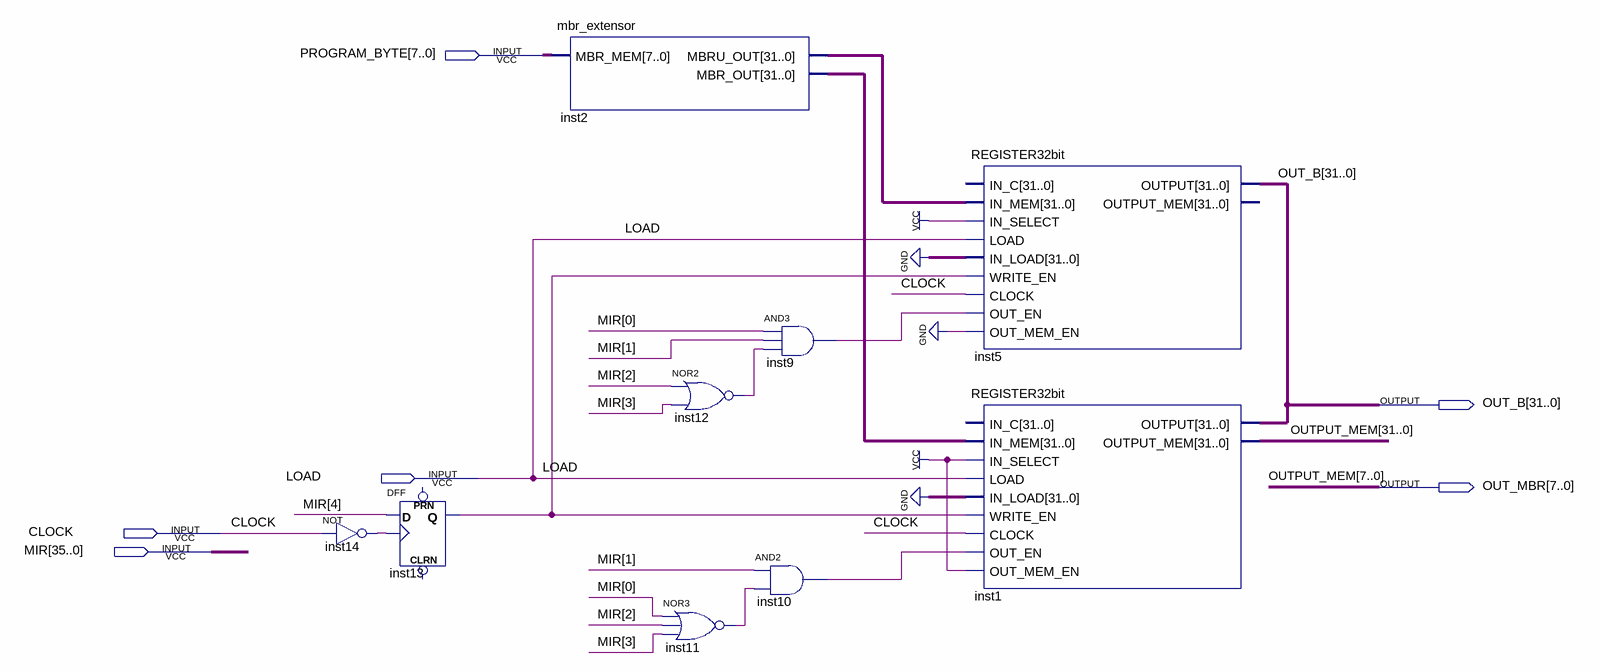
[diagram p0: schematic sheet]
// Quartus schematic MBR.bdf as structural Verilog: 9 symbols, 6 pins
module MBR (
  input  [7:0] PROGRAM_BYTE,
  input  LOAD,
  input  CLOCK,
  input  [35:0] MIR,
  output [31:0] OUT_B,
  output [7:0] OUT_MBR
);

  wire inst9_out, inst10_out, inst11_out, inst12_out, inst13_q, inst14_out;
  wire [31:0] inst2_mbr_out, inst2_mbru_out;
  wire [31:8] OUTPUT_MEM;

  DFF inst13 (.CLK(inst14_out), .D(MIR[4]), .Q(inst13_q));  // open: CLRN, PRN
  not inst14 (inst14_out, CLOCK);
  mbr_extensor inst2 (.MBR_MEM(PROGRAM_BYTE), .MBRU_OUT(inst2_mbru_out), .MBR_OUT(inst2_mbr_out));
  nor inst12 (inst12_out, MIR[2], MIR[3]);
  nor inst11 (inst11_out, MIR[0], MIR[2], MIR[3]);
  and inst10 (inst10_out, MIR[1], inst11_out);
  and inst9 (inst9_out, MIR[0], MIR[1], inst12_out);
  REGISTER32bit inst5 (
    .IN_MEM(inst2_mbru_out), .IN_SELECT(1'b1), .LOAD(LOAD), .IN_LOAD({32{1'b0}}), .WRITE_EN(inst13_q),
    .CLOCK(CLOCK), .OUT_EN(inst9_out), .OUT_MEM_EN(1'b0), .OUTPUT(OUT_B));  // open: IN_C, OUTPUT_MEM
  REGISTER32bit inst1 (
    .IN_MEM(inst2_mbr_out), .IN_SELECT(1'b1), .LOAD(LOAD), .IN_LOAD({32{1'b0}}), .WRITE_EN(inst13_q),
    .CLOCK(CLOCK), .OUT_EN(inst10_out), .OUT_MEM_EN(1'b1), .OUTPUT(OUT_B), .OUTPUT_MEM({OUTPUT_MEM, OUT_MBR}));  // open: IN_C

  // Other names for the same wires on the sheet: OUTPUT_MEM[7:0] = OUT_MBR
endmodule
